# EAGLE schematic PS4_Main_Schematic_V3 (EAGLE 9.5.2)
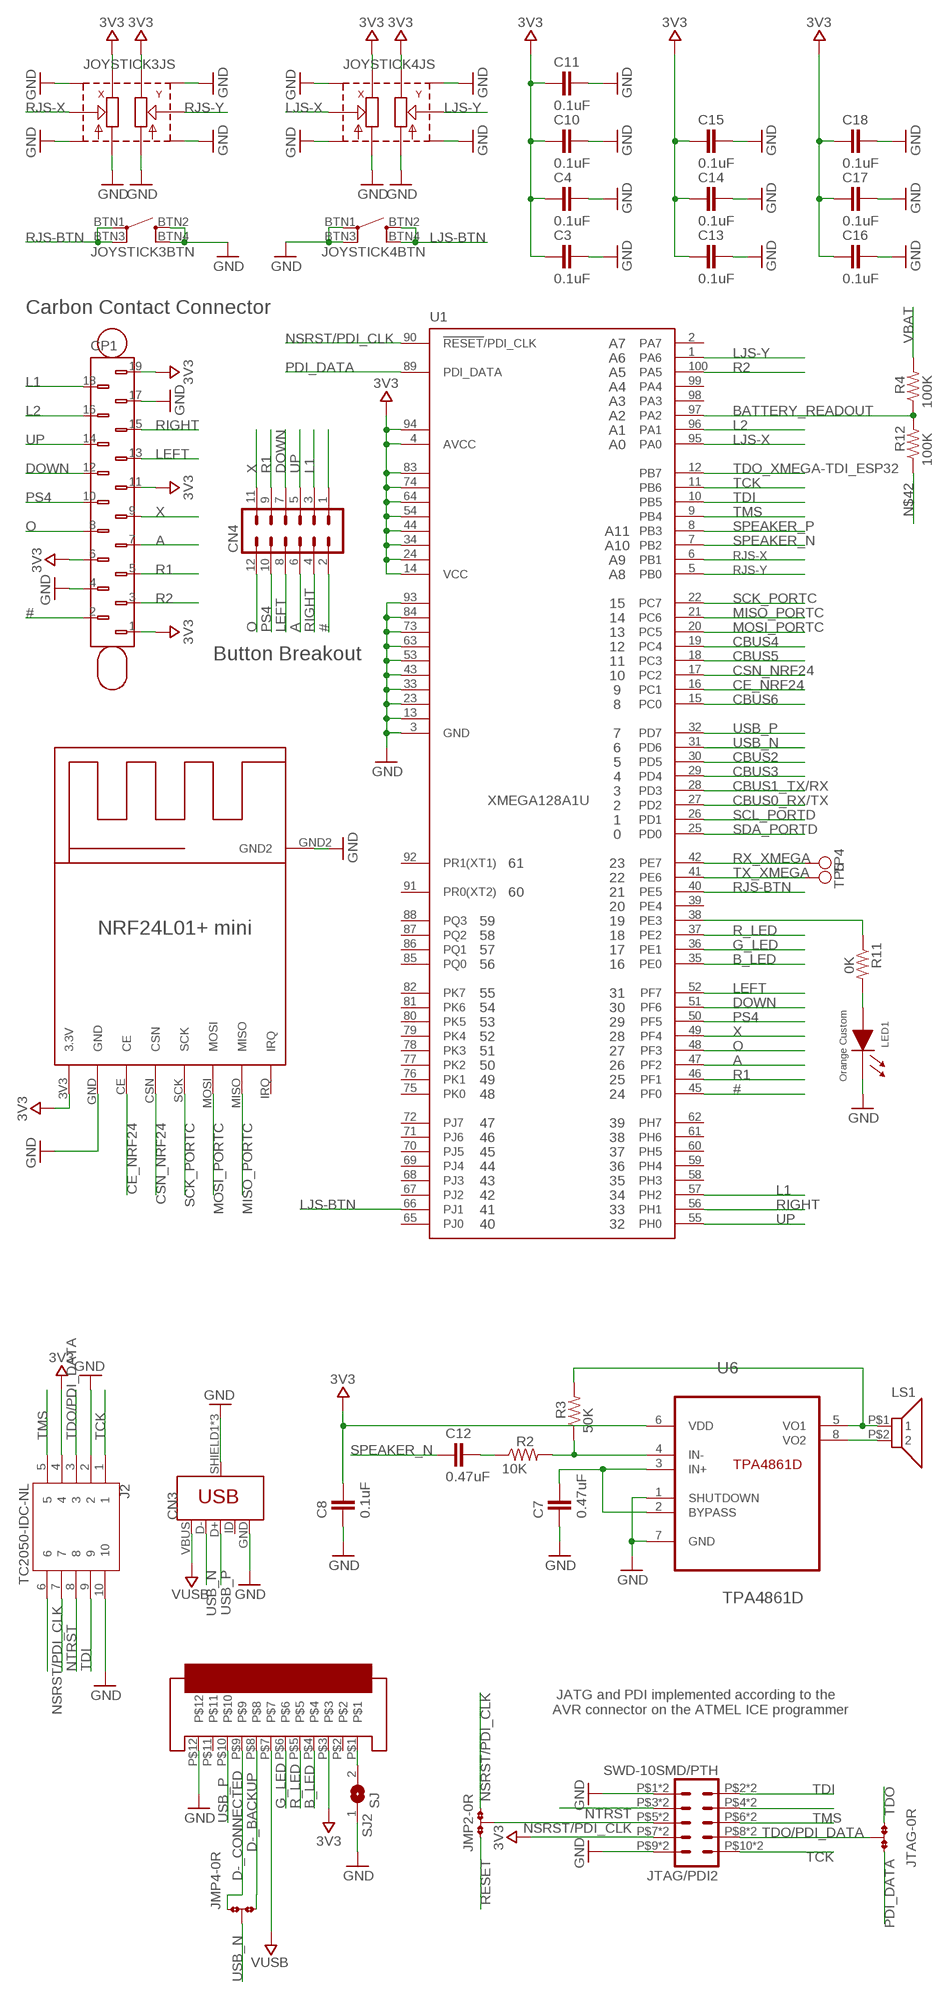
[diagram p0: schematic, sheet 1, part 1 of 2]
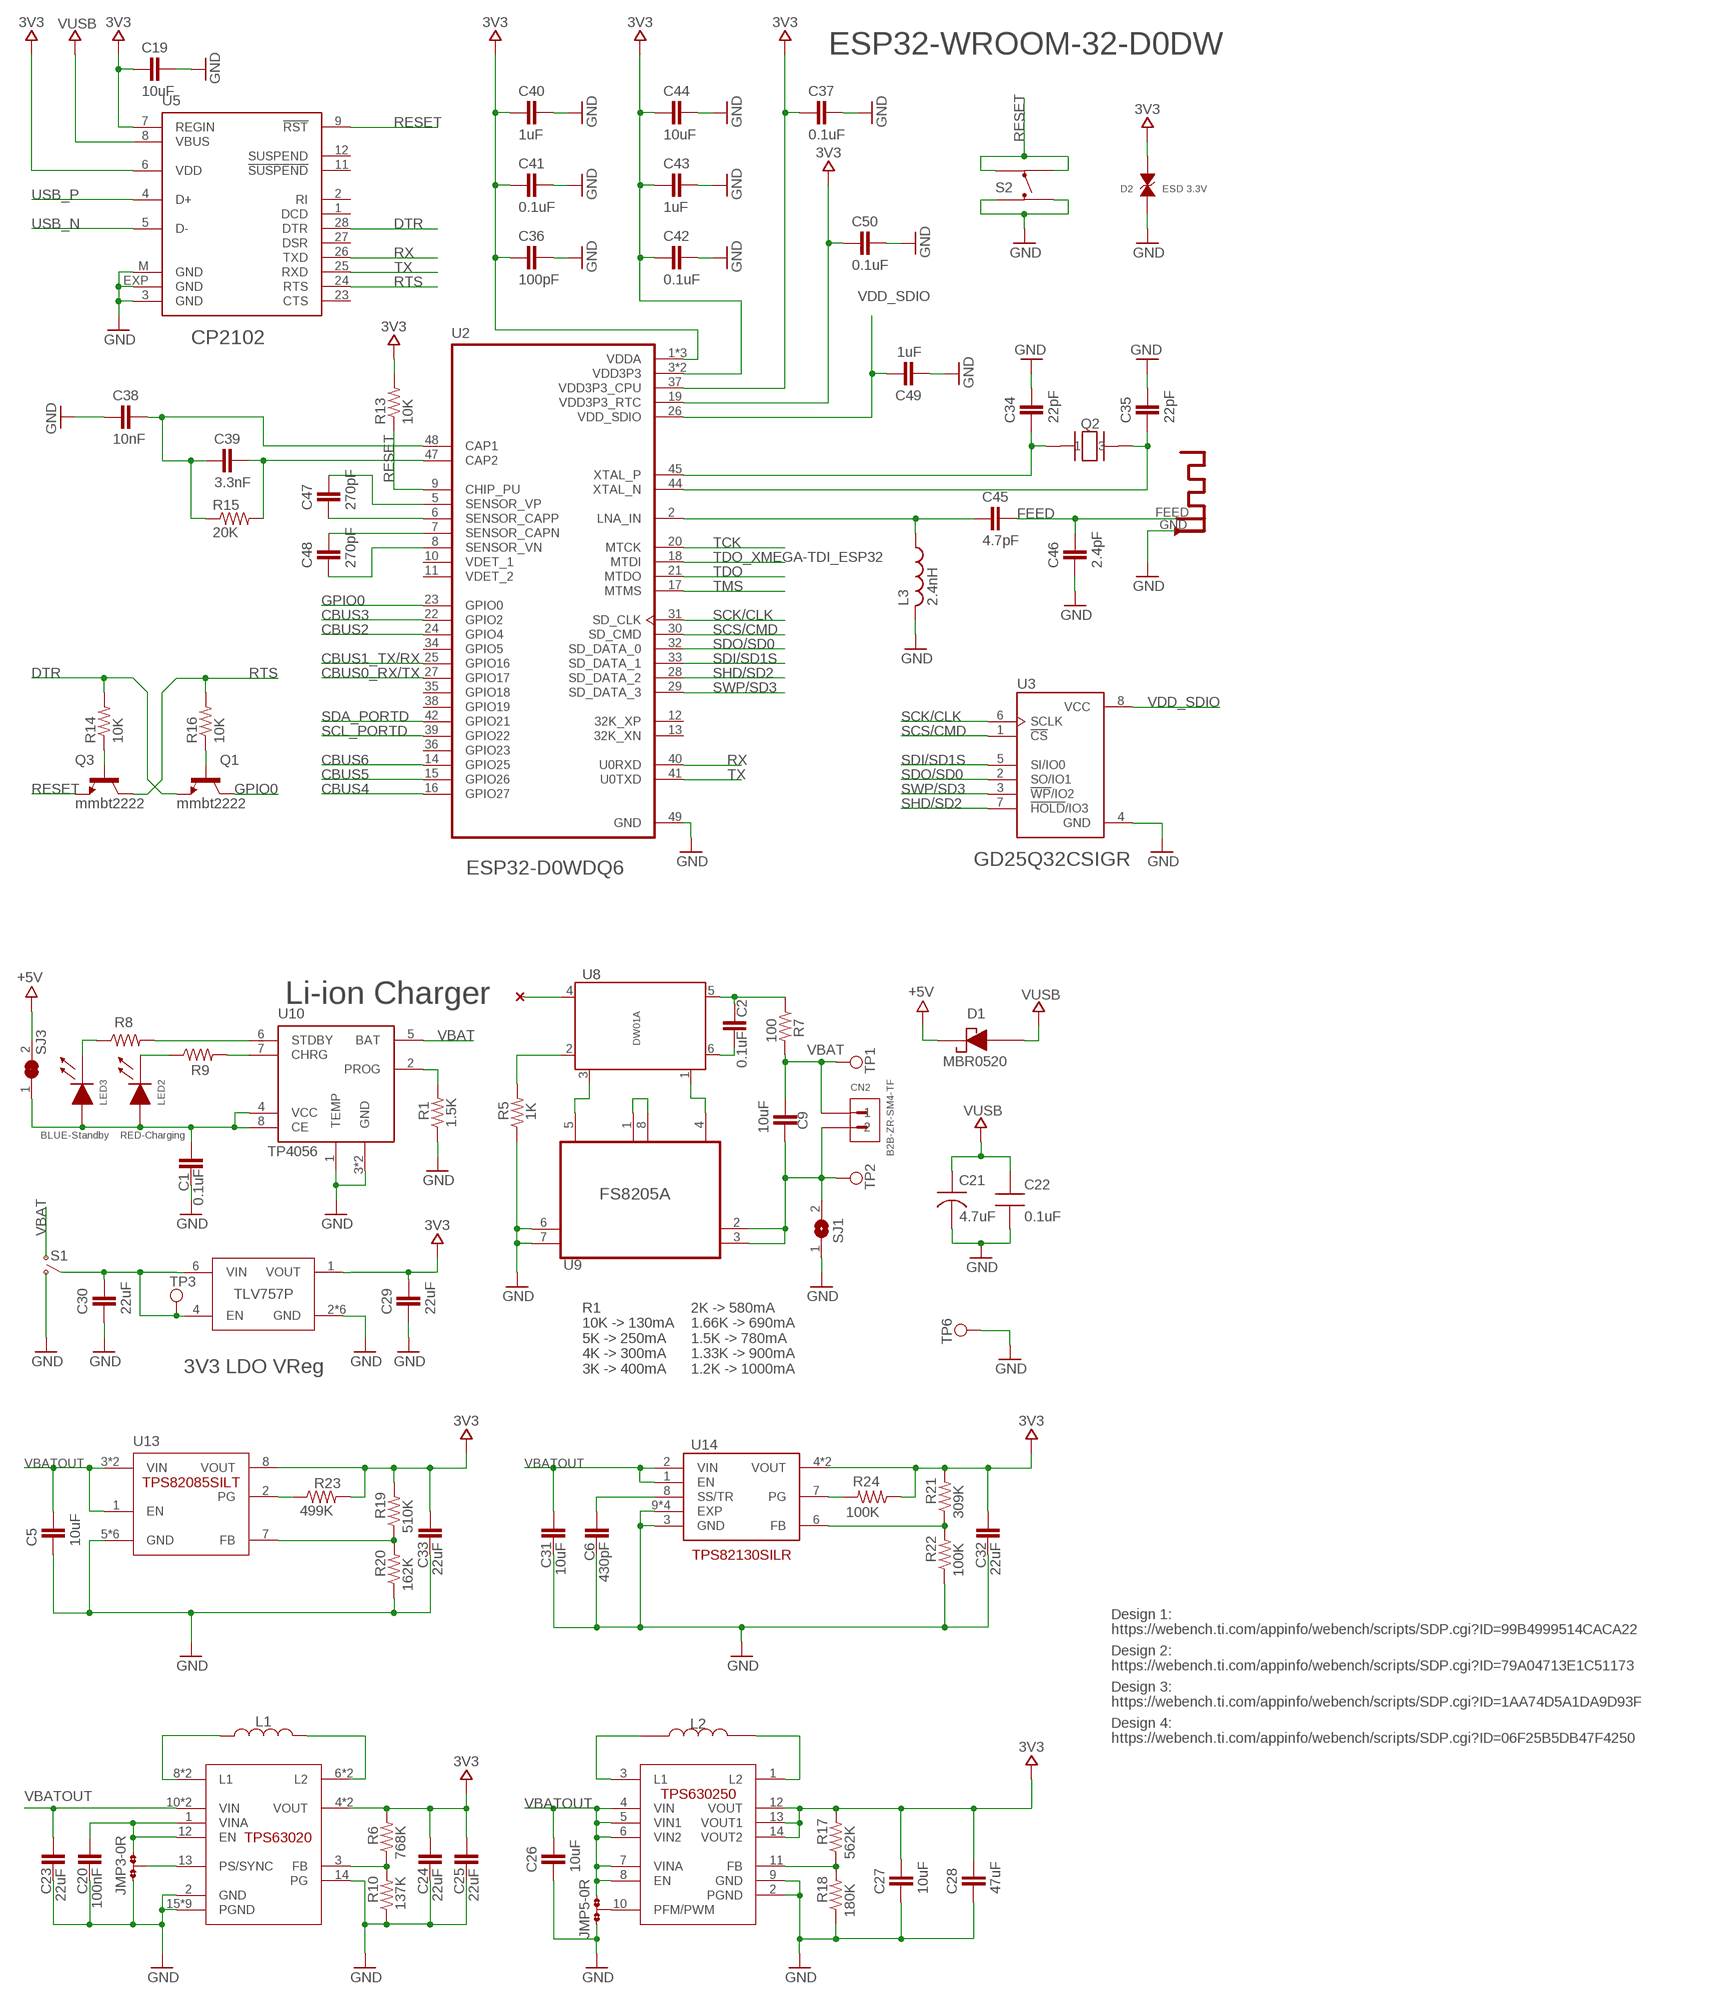
[diagram p1: schematic, sheet 1, part 2 of 2]

## Parts
ANT1  ESP32-ANTENNA  [ESP32-ANT]
C1  0.1uF  CC0402  [C0402]
C2  0.1uF  CC0603  [C0603]
C3  0.1uF  CAPACITOR04020402  [CAPC1005X60N]
C4  0.1uF  CAPACITOR04020402  [CAPC1005X60N]
C5  10uF  CAPACITOR0603  [CAPC1608X85N]
C6  430pF  CAPACITOR0603  [CAPC1608X85N]
C7  0.47uF  CAPACITOR0603  [CAPC1608X85N]
C8  0.1uF  CAPACITOR0603  [CAPC1608X85N]
C9  10uF  CC0603  [C0603]
C10  0.1uF  CAPACITOR04020402  [CAPC1005X60N]
C11  0.1uF  CAPACITOR04020402  [CAPC1005X60N]
C12  0.47uF  CAPACITOR0603  [CAPC1608X85N]
C13  0.1uF  CAPACITOR04020402  [CAPC1005X60N]
C14  0.1uF  CAPACITOR04020402  [CAPC1005X60N]
C15  0.1uF  CAPACITOR04020402  [CAPC1005X60N]
C16  0.1uF  CAPACITOR04020402  [CAPC1005X60N]
C17  0.1uF  CAPACITOR04020402  [CAPC1005X60N]
C18  0.1uF  CAPACITOR04020402  [CAPC1005X60N]
C19  10uF  CAPACITOR0603  [CAPC1608X85N]
C20  100nF  CAPACITOR0603  [CAPC1608X85N]
C21  4.7uF  CAP-TANA-P  [TAN-A]
C22  0.1uF  CAP0805-NP  [CAP0805-NP]
C23  22uF  CAPACITOR0603  [CAPC1608X85N]
C24  22uF  CAPACITOR0603  [CAPC1608X85N]
C25  22uF  CAPACITOR0603  [CAPC1608X85N]
C26  10uF  CAPACITOR0603  [CAPC1608X85N]
C27  10uF  CAPACITOR0603  [CAPC1608X85N]
C28  47uF  CAPACITOR0805  [0805]
C29  22uF  CAPACITOR0603  [CAPC1608X85N]
C30  22uF  CAPACITOR0603  [CAPC1608X85N]
C31  10uF  CAPACITOR0603  [CAPC1608X85N]
C32  22uF  CAPACITOR0603  [CAPC1608X85N]
C33  22uF  CAPACITOR0603  [CAPC1608X85N]
C34  22pF  CAPACITOR04020402  [CAPC1005X60N]
C35  22pF  CAPACITOR04020402  [CAPC1005X60N]
C36  100pF  CAPACITOR04020402  [CAPC1005X60N]
C37  0.1uF  CAPACITOR04020402  [CAPC1005X60N]
C38  10nF  CAPACITOR04020402  [CAPC1005X60N]
C39  3.3nF  CAPACITOR04020402  [CAPC1005X60N]
C40  1uF  CAPACITOR04020402  [CAPC1005X60N]
C41  0.1uF  CAPACITOR04020402  [CAPC1005X60N]
C42  0.1uF  CAPACITOR04020402  [CAPC1005X60N]
C43  1uF  CAPACITOR04020402  [CAPC1005X60N]
C44  10uF  CAPACITOR0603  [CAPC1608X85N]
C45  4.7pF  CAPACITOR04020402  [CAPC1005X60N]
C46  2.4pF  CAPACITOR04020402  [CAPC1005X60N]
C47  270pF  CAPACITOR04020402  [CAPC1005X60N]
C48  270pF  CAPACITOR04020402  [CAPC1005X60N]
C49  1uF  CAPACITOR04020402  [CAPC1005X60N]
C50  0.1uF  CAPACITOR04020402  [CAPC1005X60N]
CN1  505278-1233  [FFC-12-VERTICAL]
CN2  B2B-ZR-SM4-TF  [B2B-SM]
CN3  USB_MICRO-B_REDUCED-OVERHANG  [USB-B-MICRO-SMD-RED-OVERHANG]
CN4  MA05-2  [MA05-2]
CP1  CARBON-CONTACTS-JDM055  [CARBON-PADS-JDM055]
D1  MBR0520  [SOD-123]
D2  ESD 3.3V  621-D3V3H1B2LP-7B  [DFN100X60X45-2N]
J2  TC2050-IDC-NL  [TAG-CONNECT_TC2050-IDC-NL]
JMP2  0R-JUMPC  [C0R-JMP]
JMP3  0R-JUMPC  [C0R-JMP]
JMP4  0R-JUMPC  [C0R-JMP]
JMP5  0R-JUMPC  [C0R-JMP]
JOYSTICK3  RKJXV1224002RKJXV1224002  [RKJXV1224]
JOYSTICK4  RKJXV1224002RKJXV1224002  [RKJXV1224]
JTAG  0R-JUMPC  [C0R-JMP]
JTAG/PDI2  SWD-10SMD/PTH  [M50-3600542]
L1  SDR0403-1R0ML  [IND_SDR0403-221KL]
L2  INDUCTOR_XFL4020-102MEB  [IND_XFL4020-102MEB]
L3  2.4nH  LQP15MN2N4B02D  [INDC1005X45]
LED1  Orange Custom  LED0805  [LED0805]
LED2  RED-Charging  LED0805  [LED0805]
LED3  BLUE-Standby  LED0805  [LED0805]
LS1  SPEAKER-CONNECTORS-JDM055  [SPEAKER-CONNECTORS-JDM055]
Q1  mmbt2222  TRANSISTOR_NPNSOT23-3  [SOT23-3]
Q2  OSCCC320X250X60N  [OSCCC320X250X60N]
Q3  mmbt2222  TRANSISTOR_NPNSOT23-3  [SOT23-3]
R1  1.5K  R-US_R0603  [R0603]
R2  10K  RESISTOR0603  [CAPC1608X85N]
R3  50K  RESISTOR0603  [CAPC1608X85N]
R4  100K  RESISTOR0603  [CAPC1608X85N]
R5  1K  R-US_R0603  [R0603]
R6  768K  RESISTOR0402  [CAPC1005X60N]
R7  100  R-US_R0603  [R0603]
R8  0K  R-US_R0603  [R0603]
R9  0K  R-US_R0603  [R0603]
R10  137K  RESISTOR0402  [CAPC1005X60N]
R11  0K  R-US_R0603  [R0603]
R12  100K  RESISTOR0603  [CAPC1608X85N]
R13  10K  RESISTOR0603  [CAPC1608X85N]
R14  10K  RESISTOR0603  [CAPC1608X85N]
R15  20K  603-AC0402FR-0720KL  [603-AC0402FR-0720KL]
R16  10K  RESISTOR0603  [CAPC1608X85N]
R17  562K  RESISTOR0603  [CAPC1608X85N]
R18  180K  RESISTOR0603  [CAPC1608X85N]
R19  510K  RESISTOR0603  [CAPC1608X85N]
R20  162K  RESISTOR0603  [CAPC1608X85N]
R21  309K  RESISTOR0603  [CAPC1608X85N]
R22  100K  RESISTOR0603  [CAPC1608X85N]
R23  499K  RESISTOR0603  [CAPC1608X85N]
R24  100K  RESISTOR0603  [CAPC1608X85N]
S1  SSAJ110100  [SSAJ110100]
S2  ULTRA-THIN-TACT-SWITCHPTS540  [PTS540]
SJ1  SJ  [SJ]
SJ2  SJ  [SJ]
SJ3  SJ-CLOSED  [SJ-CLOSED]
TP1  TP  [TP]
TP2  TP  [TP]
TP3  TP  [TP]
TP4  TP  [TP]
TP5  TP  [TP]
TP6  TP  [TP]
U1  XMEGA128A1U  [TQFP100]
U2  ESP32-D0WDQ6  [QFN35P500X500X90-49N]
U3  GD25Q32CSIGR  [SOIC127P790X216-8N]
U4  NRF24MINI  [NRF24MINI]
U5  CP2102  [MLP28]
U6  TPA4861D  [SOIC127P600X175-8N]
U8  DW01A  [SOT95P285X140-6N]
U9  FS8205A  [SOP65P640X120-8N]
U10  TP4056  [SOP-8]
U11  TPS63020  [QFN14-3X4MM]
U12  TPS630250RNCT  [TPS630250]
U13  TPS82085SILT8-MICRO_SIP  [SON65P280X300X133-9N]
U14  TPS82130SILR  [PSON65P300X280X153-9N]
U$2  LDO-3V3WSON  [SON65P200X200X80-7N]

## Nets
3V3: C3.2 C4.2 C8.1 C10.2 C11.2 C13.2 C14.2 C15.2 C16.2 C17.2 C18.2 C19.2 C24.1 C25.1 C27.1 C28.1 C29.1 C32.1 C33.1 C36.2 C37.2 C40.2 C41.2 C42.2 C43.2 C44.2 C50.2 CN1.P$3 CP1.1(D1) CP1.6(D6) CP1.11(D11) CP1.19(D19) D2.2 J2.4 JOYSTICK3.X3(JS:X3) JOYSTICK3.Y3(JS:Y3) JOYSTICK4.X3(JS:X3) JOYSTICK4.Y3(JS:Y3) JTAG/PDI2.P$7 JTAG/PDI2.P$7_1 R6.2 R13.2 R17.2 R19.2 R21.2 R23.2 R24.1 U1.4(AVCC) U1.14(VCC) U1.24(VCC1) U1.34(VCC2) U1.44(VCC3) U1.54(VCC4) U1.64(VCC5) U1.74(VCC6) U1.83(VCC7) U1.94(AVCC1) U2.1(VDDA) U2.3(VDD3P3) U2.4(VDD3P3) U2.19(VDD3P3_RTC) U2.37(VDD3P3_CPU) U2.43(VDDA) U2.46(VDDA) U4.3V3(3.3V) U5.6(VDD) U5.7(REGIN) U6.6(VDD) U11.4(VOUT) U11.5(VOUT) U12.12(VOUT) U12.13(VOUT1) U12.14(VOUT2) U13.8(VOUT) U14.4(VOUT) U14.5(VOUT) U$2.1(VOUT)
#: CN4.2 CP1.2(D2) U1.45(PF0)
+5V: D1.1(CA) SJ3.2
A: CN4.6 CP1.7(D7) U1.47(PF2)
B_LED: CN1.P$4 U1.35(PE0)
BATTERY_READOUT: R4.1 R12.2 U1.97(PA2)
CBUS0_RX/TX: U1.27(PD2) U2.27(GPIO17)
CBUS1_TX/RX: U1.28(PD3) U2.25(GPIO16)
CBUS2: U1.30(PD5) U2.24(GPIO4)
CBUS3: U1.29(PD4) U2.22(GPIO2)
CBUS4: U1.19(PC4) U2.16(GPIO27)
CBUS5: U1.18(PC3) U2.15(GPIO26)
CBUS6: U1.15(PC0) U2.14(GPIO25)
CE_NRF24: U1.16(PC1) U4.CE
CSN_NRF24: U1.17(PC2) U4.CSN
D-_BACKUP: CN1.P$8 JMP4.1
D-_CONNECTED: CN1.P$9 JMP4.3
DOWN: CN4.7 CP1.12(D12) U1.51(PF6)
DTR: Q1.2(E) R14.2 U5.28(DTR)
FEED: ANT1.FEED C45.1 C46.1
G_LED: CN1.P$6 U1.36(PE1)
GND: ANT1.GND C1.2 C3.1 C4.1 C5.2 C6.2 C7.2 C8.2 C10.1 C11.1 C13.1 C14.1 C15.1 C16.1 C17.1 C18.1 C19.1 C20.2 C21.2 C22.2 C23.2 C24.2 C25.2 C26.2 C27.2 C28.2 C29.2 C30.2 C31.2 C32.2 C33.2 C34.1 C35.1 C36.1 C37.1 C38.2 C40.1 C41.1 C42.1 C43.1 C44.1 C46.2 C49.2 C50.1 CN1.P$12 CN3.GND CN3.SHIELD1(SHIELD) CN3.SHIELD2(SHIELD) CN3.SHIELD3(SHIELD) CP1.4(D4) CP1.17(D17) D2.1 J2.2 J2.10 JMP3.3 JMP5.3 JOYSTICK3.BTN2 JOYSTICK3.BTN4 JOYSTICK3.CASE1(JS:CASE1) JOYSTICK3.CASE2(JS:CASE2) JOYSTICK3.CASE3(JS:CASE3) JOYSTICK3.CASE4(JS:CASE4) JOYSTICK3.X1(JS:X1) JOYSTICK3.Y1(JS:Y1) JOYSTICK4.BTN1 JOYSTICK4.BTN3 JOYSTICK4.CASE1(JS:CASE1) JOYSTICK4.CASE2(JS:CASE2) JOYSTICK4.CASE3(JS:CASE3) JOYSTICK4.CASE4(JS:CASE4) JOYSTICK4.X1(JS:X1) JOYSTICK4.Y1(JS:Y1) JTAG/PDI2.P$1 JTAG/PDI2.P$1_1 JTAG/PDI2.P$9 JTAG/PDI2.P$9_1 L3.2 LED1.1(CA) R1.1 R5.1 R10.1 R18.1 R20.1 R22.1 S1.1(A) S2.3 S2.4 SJ1.1 SJ2.1 TP6.TP U1.3(GND) U1.13(GND1) U1.23(GND2) U1.33(GND3) U1.43(GND4) U1.53(GND5) U1.63(GND6) U1.73(GND7) U1.84(GND8) U1.93(GND9) U2.49(GND) U3.4(GND) U4.GND U4.GND2 U5.3(GND) U5.EXP(GND) U5.M(GND) U6.1(SHUTDOWN) U6.7(GND) U9.6 U9.7 U10.1(TEMP) U10.3(GND) U10.9(GND) U11.2(GND) U11.14(PG) U11.15(PGND) U11.16(PGND) U11.17(PGND) U11.18(PGND) U11.19(PGND) U11.20(PGND) U11.21(PGND) U11.22(PGND) U11.23(PGND) U12.2(PGND) U12.9(GND) U13.5(GND) U13.6(GND) U13.9(GND) U13.P$1(GND) U13.P$2(GND) U13.P$3(GND) U14.3(GND) U14.9(EXP) U14.9_1(EXP) U14.9_2(EXP) U14.9_3(EXP) U$2.2(GND) U$2.3(GND) U$2.5(GND) U$2.7(GND) U$2.7_1(GND) U$2.7_2(GND)
GPIO0: Q1.3(C) U2.23(GPIO0)
L1: CN4.3 CP1.18(D18) U1.57(PH2)
L2: CP1.16(D16) U1.96(PA1)
LEFT: CN4.8 CP1.13(D13) U1.52(PF7)
LJS-BTN: JOYSTICK4.BTN2 JOYSTICK4.BTN4 U1.66(PJ1)
LJS-X: JOYSTICK4.X2(JS:X2) U1.95(PA0)
LJS-Y: JOYSTICK4.Y2(JS:Y2) U1.1(PA6)
MISO_PORTC: U1.21(PC6) U4.MISO
MOSI_PORTC: U1.20(PC5) U4.MOSI
N$1: L1.1 U11.8(L1) U11.9(L1)
N$2: J2.6
N$3: C12.1 R2.1
N$4: R2.2 R3.1 U6.4(IN-)
N$7: L1.2 U11.6(L2) U11.7(L2)
N$8: R5.2 U8.2
N$9: C2.1 R7.1 U8.5
N$10: U8.3 U9.5
N$11: U8.1 U9.4
N$14: JTAG/PDI2.P$4 JTAG/PDI2.P$4_1
N$41: C2.2 U8.6
N$42 [GND]: C9.2 CN2.P$2 R12.1 SJ1.2 TP2.TP U9.2 U9.3
N$43: U9.1 U9.8
N$44: R1.2 U10.2(PROG)
N$45: LED2.1(CA) R9.1
N$46: LED3.1(CA) R8.1
N$47: R9.2 U10.7(CHRG)
N$49: R8.2 U10.6(STDBY)
N$51 [+5V]: C1.1 LED2.2(AN) LED3.2(AN) SJ3.1 U10.4(VCC) U10.8(CE)
N$52: U8.4
N$53: CN1.P$1 SJ2.2
N$55: Q1.1(B) R16.1
N$56: Q3.1(B) R14.1
N$57: L2.1 U12.3(L1)
N$58: JMP3.2 U11.13(PS/SYNC)
N$59: R11.1 U1.38(PE3)
N$60: LED1.2(AN) R11.2
N$61: R19.1 R20.2 U13.7(FB)
N$62: R6.1 R10.2 U11.3(FB)
N$63: L2.2 U12.1(L2)
N$64: C20.1 JMP3.1 U11.1(VINA) U11.12(EN)
N$65: LS1.P$2 U6.8(VO2)
N$66: LS1.P$1 R3.2 U6.5(VO1)
N$69: R21.1 R22.2 U14.6(FB)
N$70: R17.1 R18.2 U12.11(FB)
N$71: R23.1 U13.2(PG)
N$72: R24.2 U14.7(PG)
N$74: JMP5.2 U12.10(PFM/PWM)
N$75: C6.1 U14.8(SS/TR)
N$76: CN4.1
N$112: C34.2 Q2.1 U2.45(XTAL_P)
N$113: C35.2 Q2.3 U2.44(XTAL_N)
N$114: C45.2 L3.1 U2.2(LNA_IN)
N$115: C48.1 U2.7(SENSOR_CAPN)
N$116: C47.2 U2.6(SENSOR_CAPP)
N$117: C47.1 U2.5(SENSOR_VP)
N$118: C48.2 U2.8(SENSOR_VN)
N$119: C39.1 R15.2 U2.47(CAP2)
N$120: C38.1 C39.2 R15.1 U2.48(CAP1)
NSRST/PDI_CLK: J2.7 JMP2.1 JMP2.2 JTAG/PDI2.P$5 JTAG/PDI2.P$5_1 U1.90(!RESET!/PDI_CLK)
NTRST: J2.8 JTAG/PDI2.P$3 JTAG/PDI2.P$3_1
O: CN4.12 CP1.8(D8) U1.48(PF3)
PDI_DATA: JTAG.1 U1.89(PDI_DATA)
PS4: CN4.10 CP1.10(D10) U1.50(PF5)
R1: CN4.9 CP1.5(D5) U1.46(PF1)
R2: CP1.3(D3) U1.100(PA5)
R_LED: CN1.P$5 U1.37(PE2)
RESET: JMP2.3 Q3.2(E) R13.1 S2.1 S2.2 U2.9(CHIP_PU) U5.9(!RST)
RIGHT: CN4.4 CP1.15(D15) U1.56(PH1)
RJS-BTN: JOYSTICK3.BTN1 JOYSTICK3.BTN3 U1.40(PE5)
RJS-X: JOYSTICK3.X2(JS:X2) U1.6(PB1)
RJS-Y: JOYSTICK3.Y2(JS:Y2) U1.5(PB0)
RTS: Q3.3(C) R16.2 U5.24(RTS)
RX: U2.40(U0RXD) U5.26(TXD)
RX_XMEGA: TP4.TP U1.42(PE7)
SCK/CLK: U2.31(SD_CLK) U3.6(SCLK)
SCK_PORTC: U1.22(PC7) U4.SCK
SCL_PORTD: U1.26(PD1) U2.39(GPIO22)
SCS/CMD: U2.30(SD_CMD) U3.1(!CS)
SDA_PORTD: U1.25(PD0) U2.42(GPIO21)
SDI/SD1S: U2.33(SD_DATA_1) U3.5(SI/IO0)
SDO/SD0: U2.32(SD_DATA_0) U3.2(SO/IO1)
SHD/SD2: U2.28(SD_DATA_2) U3.7(!HOLD!/IO3)
SPEAKER_N: C12.2 U1.7(PB2)
SPEAKER_P: C7.1 U1.8(PB3) U6.2(BYPASS) U6.3(IN+)
SWP/SD3: U2.29(SD_DATA_3) U3.3(!WP!/IO2)
TCK: J2.1 JTAG/PDI2.P10_1 JTAG/PDI2.P$10 U1.11(PB6) U2.20(MTCK)
TDI: J2.9 JTAG/PDI2.P$2 JTAG/PDI2.P$2_1 U1.10(PB5)
TDO: JTAG.3 U2.21(MTDO)
TDO/PDI_DATA: J2.3 JTAG.2 JTAG/PDI2.P$8 JTAG/PDI2.P$8_1
TDO_XMEGA-TDI_ESP32: U1.12(PB7) U2.18(MTDI)
TMS: J2.5 JTAG/PDI2.P$6 JTAG/PDI2.P$6_1 U1.9(PB4) U2.17(MTMS)
TX: U2.41(U0TXD) U5.25(RXD)
TX_XMEGA: TP5.TP U1.41(PE6)
UP: CN4.5 CP1.14(D14) U1.55(PH0)
USB_N: CN3.D- JMP4.2 U1.31(PD6) U5.5(D-)
USB_P: CN1.P$10 CN3.D+ U1.32(PD7) U5.4(D+)
VBAT [+5V]: C9.1 CN2.P$1 R4.2 R7.2 S1.2(B) TP1.TP U10.5(BAT)
VBATOUT [+5V]: C5.1 C23.1 C26.1 C30.1 C31.1 JMP5.1 S1.C(COM) TP3.TP U11.10(VIN) U11.11(VIN) U12.4(VIN) U12.5(VIN1) U12.6(VIN2) U12.7(VINA) U12.8(EN) U13.1(EN) U13.3(VIN) U13.4(VIN) U14.1(EN) U14.2(VIN) U$2.4(EN) U$2.6(VIN)
VDD_SDIO: C49.1 U2.26(VDD_SDIO) U3.8(VCC)
VUSB: C21.1 C22.1 CN1.P$7 CN3.VBUS D1.2(AN) U5.8(VBUS)
X: CN4.11 CP1.9(D9) U1.49(PF4)
Unconnected: CN1.P$2 CN1.P$11 CN3.ID U1.2(PA7) U1.39(PE4) U1.58(PH3) U1.59(PH4) U1.60(PH5) U1.61(PH6) U1.62(PH7) U1.65(PJ0) U1.67(PJ2) U1.68(PJ3) U1.69(PJ4) U1.70(PJ5) U1.71(PJ6) U1.72(PJ7) U1.75(PK0) U1.76(PK1) U1.77(PK2) U1.78(PK3) U1.79(PK4) U1.80(PK5) U1.81(PK6) U1.82(PK7) U1.85(PQ0) U1.86(PQ1) U1.87(PQ2) U1.88(PQ3) U1.91(PR0(XT2)) U1.92(PR1(XT1)) U1.98(PA3) U1.99(PA4) U2.10(VDET_1) U2.11(VDET_2) U2.12(32K_XP) U2.13(32K_XN) U2.34(GPIO5) U2.35(GPIO18) U2.36(GPIO23) U2.38(GPIO19) U4.IRQ U5.1(DCD) U5.2(RI) U5.11(!SUSPEND) U5.12(SUSPEND) U5.23(CTS) U5.27(DSR)

## Notes on the sheet
- ESP32-WROOM-32-D0DW
- Carbon Contact Connector
- Button Breakout
- GD25Q32CSIGR
- NRF24L01+ mini
- Li-ion Charger
- 3V3 LDO VReg
- R1
  10K -> 130mA
  5K -> 250mA
  4K -> 300mA
  3K -> 400mA
- 2K -> 580mA
  1.66K -> 690mA
  1.5K -> 780mA
  1.33K -> 900mA
  1.2K -> 1000mA
- Design 1:
  https://webench.ti.com/appinfo/webench/scripts/SDP.cgi?ID=99B4999514CACA22
- Design 2:
  https://webench.ti.com/appinfo/webench/scripts/SDP.cgi?ID=79A04713E1C51173
- Design 3:
  https://webench.ti.com/appinfo/webench/scripts/SDP.cgi?ID=1AA74D5A1DA9D93F
- JATG and PDI implemented according to the 
  AVR connector on the ATMEL ICE programmer
- Design 4:
  https://webench.ti.com/appinfo/webench/scripts/SDP.cgi?ID=06F25B5DB47F4250

## Power pins joined to a net without a drawn wire
GND: CN1.GND1(GND) CN1.GND2(GND) CN1.GND3(GND) CN1.GND4(GND) Q2.2(GND) Q2.4(GND)

## Library data of the parts
ANT1 = BLU:ESP32-ANTENNA
C1 C2 C9 = eagle-ltspice:C: CAPACITOR, European symbol; SPICEMODEL: NONE; SPICEPREFIX: C
C3-C8 C10-C20 C23-C50 = BLU:CAPACITOR
C21 = MySMD:CAP-TANA-P
C22 = MySMD:CAP0805-NP
CN1 = BLU:505278-1233: 5052781433 - FFC Connector Technical Specifications: Brand: Molex Series: 505278 Number of Positions: 14 Position Brand: Pitch: 0.5 mm Termination Style: SMD Mounting Angle: Right Angle Contact Location: Bottom Contact Actuation Type: ZIF Operating Temperature: -40°C to 85°C Voltage Rating: 50 V Current Rating: 500 mA Contact Plating: Tin Contact Material: Phosphor Bronze Housing Material: Liquid Crystal Polymer (LCP) Mouser No: 538-505278-1433 Mfr. No: 505278-1433
CN2 = BLU:B2B-ZR-SM4-TF: JST 2 pin connector; AVAILABILITY: Unavailable; DESCRIPTION: Connector Header Surface Mount 2 position 0.059 _1.50mm_; MF: JST Sales; MP: B2B-ZR-SM4-TF; PACKAGE: None; PRICE: None
CN3 = BLU:USB_MICRO-B: USB Type Micro-B Connector Male/female and PTH/SMT variants SparkFun Products: SparkFun microB USB Breakout <https://www.sparkfun.com/products/12035> SparkFun USB microB Plug Breakout <https://www.sparkfun.com/products/10031> SparkFun ESP8266 Thing <https://www.sparkfun.com/products/13231>
CN4 = BLU:MA05-2: PIN HEADER; OC_FARNELL: unknown; OC_NEWARK: unknown
CP1 = BLU:CARBON-CONTACTS-JDM055
D1 = MySMD:MBR0520
D2 = BLU:621-D3V3H1B2LP-7B
J2 = TC2050-IDC-NL:TC2050-IDC-NL: Cbl Plug-Of-Nails 10-Pin; AVAILABILITY: Unavailable; DESCRIPTION: Plug-Of-Nails™ Adapter Cable; MF: Tag-Connect LLC; MP: TC2050-IDC-NL; PACKAGE: None; PRICE: None
JMP2-JMP5 JTAG = BLU:0R-JUMP: SMD 0R 0805 Jumper
JOYSTICK3 JOYSTICK4 = BLU:RKJXV1224002: Stick Controller ALPS Electric Co RKJXV1224 Joystick w/ Center Button Reichelt Order No. RKJXV122002 ?? not sure
JTAG/PDI2 = BLU:SWD-10
L1 = BLU:SDR0403-1R0ML: Inductor Power Wirewound 220uH 10% 1KHz 50Q-Factor Ferrite 220mA 4.4Ohm DCR T/R; AVAILABILITY: Unavailable; DESCRIPTION: 220µH Unshielded Wirewound Inductor 220mA 4.4Ohm Max Nonstandard; MF: Bourns; MP: SDR0403-221KL; PACKAGE: 1008 Bourns; PRICE: None
L2 = BLU:INDUCTOR: Power inductor, shielded, 20% tol, SMT, RoHS, halogen free; AVAILABILITY: Unavailable; DESCRIPTION: Power inductor, shielded, 20% tol, SMT, RoHS, halogen free; MF: Coilcraft; MP: XFL4020-102MEB; PACKAGE: None; PRICE: None
L3 = BLU:LQP15MN2N4B02D
LED1-LED3 = MySMD:LED0805
LS1 = BLU:SPEAKER-CONNECTORS-JDM055
Q1 Q3 = SparkFun:TRANSISTOR_NPN: Transistor NPN BJT configuration in SOT23 package. MMBT2222 is the common NPN we use. Double check BCE configuration again layout.
Q2 = BLU:OSCCC320X250X60N: Oscillator 40MGHz
R1 R5 R7-R9 R11 = rcl:R-US_: RESISTOR, American symbol; SPICEPREFIX: R
R2-R4 R6 R10 R12-R14 R16-R24 = BLU:RESISTOR
R15 = BLU:603-AC0402FR-0720KL
S1 = BLU:SSAJ110100; AVAILABILITY: Unavailable; DESCRIPTION: Slide Switch • Rating _max._: 10 mA 5 VDC • Poles: 1 • Positions: 2 • Travel : 1.4 mm • Operating direction: Horizontal; MF: ALPS; MP: SSAJ110100; PACKAGE: None; PRICE: None
S2 = BLU:ULTRA-THIN-TACT-SWITCH
SJ1 SJ2 = BLU:SJ
SJ3 = BLU:SJ-CLOSED
TP1-TP6 = BLU:TP
U1 = BLU:XMEGA128A1U: MICROCONTROLLER Features High-performance, Low-power 8/16-bit AVR XMEGA Microcontroller Non-Volatile Program and Data Memories - 64K - 384K Bytes of In-System Self-Programmable Flash - 4K - 8K Bytes Boot Section with Independent Lock Bits - 2 KB - 4 KB EEPROM - 4 KB - 32 KB Internal SRAM External Bus Interface for up to 16M bytes SRAM External Bus Interface for up to 128M bit SDRAM Peripheral Features - Four-channel DMA Controller with support for external requests - Eight-channel Event System - Eight 16-bit Timer/Counters Four Timer/Counters with 4 Output Compare or Input Capture channels Four Timer/Counters with 2 Output Compare or Input Capture channels High-Resolution Extension on all Timer/Counters Advanced Waveform Extension on two Timer/Counters - Eight USARTs IrDA modulation/demodulation for one USART - Four Two-Wire Interfaces with dual address match (I2C and SMBus compatible) - Four SPI (Serial Peripheral Interface) peripherals - AES and DES Crypto Engine - 16-bit Real Time Counter with separate Oscillator - Two Eight-channel, 12-bit, 2 Msps Analog to Digital Converters - Two Two-channel, 12-bit, 1 Msps Digital to Analog Converters - Four Analog Comparators with Window compare function - External Interrupts on all General Purpose I/O pins - Programmable Watchdog Timer with Separate On-chip Ultra Low Power Oscillator Special Microcontroller Features - Power-on Reset and Programmable Brown-out Detection - Internal and External Clock Options with PLL and Prescaler - Programmable Multi-level Interrupt Controller - Sleep Modes: Idle, Power-down, Standby, Power-save, Extended Standby - Advanced Programming, Test and Debugging Interfaces JTAG (IEEE 1149.1 Compliant) Interface for programming, test and debugging PDI (Program and Debug Interface) for programming and debugging I/O and Packages - 78 Programmable I/O Lines - 100 - lead TQFP - 100 - ball CBGA - 100 - ball VFBGA Operating Voltage - 1.6 - 3.6V Speed performance - 0 - 12 MHz @ 1.6 - 3.6V - 0 - 32 MHz @ 2.7 - 3.6V Drawn by Dipl.-Ing. (FH) Robert Siegler Created: 27.05.09; OC_FARNELL: unknown; OC_NEWARK: unknown
U2 = ESP32-D0WDQ6:ESP32-D0WDQ6: SoC; 2, 412G÷2, 484GHz; -98dBm; 2.2÷3.6VDC; SMD; QFN48; 19.5dBm; 16MB; DESCRIPTION: SoC; 2, 412G÷2, 484GHz; -98dBm; 2.2÷3.6VDC; SMD; QFN48; 19.5dBm; 16MB; DIGI-KEY_PART_NUMBER: 1904-1004-1-ND; DIGI-KEY_PURCHASE_URL: https://www.digikey.com/product-detail/en/espressif-systems/ESP32-D0WDQ6/1904-1004-1-ND/8028411?utm_source=snapeda&utm_medium=aggregator&utm_campaign=symbol; MF: Espressif Systems; MP: ESP32-D0WDQ6; PACKAGE: VFQFN-48 Espressif Systems
U3 = BLU:GD25Q32CSIGR: NOR FLASH Source: Datasheet <http://www.gigadevice.com/datasheet/gd25q32c/>; DESCRIPTION: NOR FLASH; HEIGHT: 2.16mm; MANUFACTURER_NAME: GigaDevice Semiconductor (HK) Limited; MANUFACTURER_PART_NUMBER: GD25Q32CSIGR
U4 = BLU:NRF24MINI
U5 = silabs:CP210*: Single-Chip USB to UART Bridge Source: www.silabs.com .. CP2101.pdf / cp2102.pdf; MF: FARNELL; MPN: CP2102-GM; OC_FARNELL: 9282130; OC_NEWARK: 30K5635
U6 = BLU:TPA4861D: 1-W MONO AUDIO POWER AMPLIFIER; AVAILABILITY: Unavailable; DESCRIPTION: Audio Amp Speaker 1-CH Mono 1.1W Class-AB 8-Pin SOIC Tube; MF: Texas Instruments; MP: TPA4861D; PACKAGE: SOIC-8 Texas Instruments; PRICE: None
U8 = BLU:DW01A: ZXTC2062E6 Series NPN/PNP 20 V 4 / 3.5 A Medium Power Transistor SMT - SOT-23-6; AVAILABILITY: Unavailable; DESCRIPTION: ZXTC2062E6 Series NPN/PNP 20 V 4 / 3.5 A Medium Power Transistor SMT - SOT-23-6; MF: Diodes Inc.; MP: ZXTC2062E6TA; PACKAGE: SOT-23-6 Diodes Inc.; PRICE: None
U9 = BLU:FS8205A: IC, EEPROM 128KBIT SERIAL 400KHZ; AVAILABILITY: Unavailable; DESCRIPTION: 24LC128 Series 128 kb I2C 2 Wire _16 k x 8 Bit_ 2.5 V Serial EEPROM SMT - TSSOP8; MF: Microchip; MP: 24LC128-E/ST; PACKAGE: TSSOP-8 Microchip; PRICE: None
U10 = BLU:TP4056; AVAILABILITY: Unavailable; MF: NanJing Top Power ASIC Corp.; MP: TP4056; PACKAGE: Package Analog Devices; PRICE: None
U11 = BLU:TPS63020: DC DC Converter: Buck-Boost
U12 = BLU:TPS630250
U13 = BLU:TPS82085SILT: Low Profile 3V3 DC DC Converter
U14 = BLU:TPS82130SILR: 3-A 17V Step-down Converter Module with Integrated Inductor 8-uSiP -40 to 125; AVAILABILITY: Unavailable; DESCRIPTION: Non-Isolated PoL Module DC DC Converter 1 Output 0.9 ~ 5V 3A 3V - 17V Input; MF: Texas Instruments; MP: TPS82130SILR; PACKAGE: SMD-8 Texas Instruments; PRICE: None
U$2 = BLU:LDO-3V3

## Net classes
0 Signals: width 0.152 mm, drill 0.3 mm, clearance 0.205 mm
1 +5V: width 0.508 mm, drill 0.3 mm, clearance 0.205 mm
2 +3V3: width 0.381 mm, drill 0.3 mm, clearance 0.205 mm
3 GND: width 0.381 mm, drill 0.3 mm, clearance 0.205 mm